# Altium schematic sheet CATS-FAT-Storage.SchDoc: CATS Pro
size A4; Author: Luca Jost; Revision: 1.0; SheetNumber: 8; SheetTotal: 13; Subtitle: Flash Memory
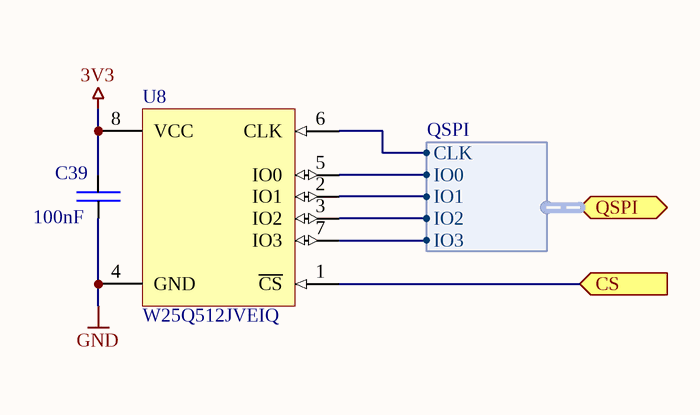
[diagram p0: CATS-FAT-Storage.SchDoc]

## Parts
C39  100nF  [SMD Keramikkondensator 0603]
U8  W25Q512JVEIQ  [SMD IC WSON-8 [8x6]]

## Ports
CS (in), QSPI (bidir, harness QSPI)

## Harnesses
QSPI: CLK, IO0, IO1, IO2, IO3

## Nets
3V3: C39.2 U8.8(VCC)
GND: C39.1 U8.4(GND)
CS: U8.1(~{CS}) ; port CS
NetU8_2: U8.2(IO1) ; port QSPI.IO1
NetU8_3: U8.3(IO2) ; port QSPI.IO2
NetU8_5: U8.5(IO0) ; port QSPI.IO0
NetU8_6: U8.6(CLK) ; port QSPI.CLK
NetU8_7: U8.7(IO3) ; port QSPI.IO3

## Notes on the sheet
- Title
- Author:
- Subtitle
- Date:
- Rev:
- CATS
- Sheet
- of
- File:

## Library data of the parts
C39 = E6 - 100nF: SMD Ceramic Capacitor E6; Unit Price: 0.01; Number: -; Supplier: -
U8 = W25Q512JVEIQ: FLASH - NOR Memory IC 512Mb (64M x 8) SPI - Quad I/O 133MHz 8-WSON (8x6); Item Description: Flash Memory; Digikey: W25Q512JVEIQ-ND; ComponentLink1Description: Datasheet; ComponentLink1URL: https://www.winbond.com/resource-files/W25Q512JV%20SPI%20RevB%2006252019%20KMS.pdf